# EasyEDA Pro project ProProject_ESP32-Gateway_2023-11-01.epro, board PCB1
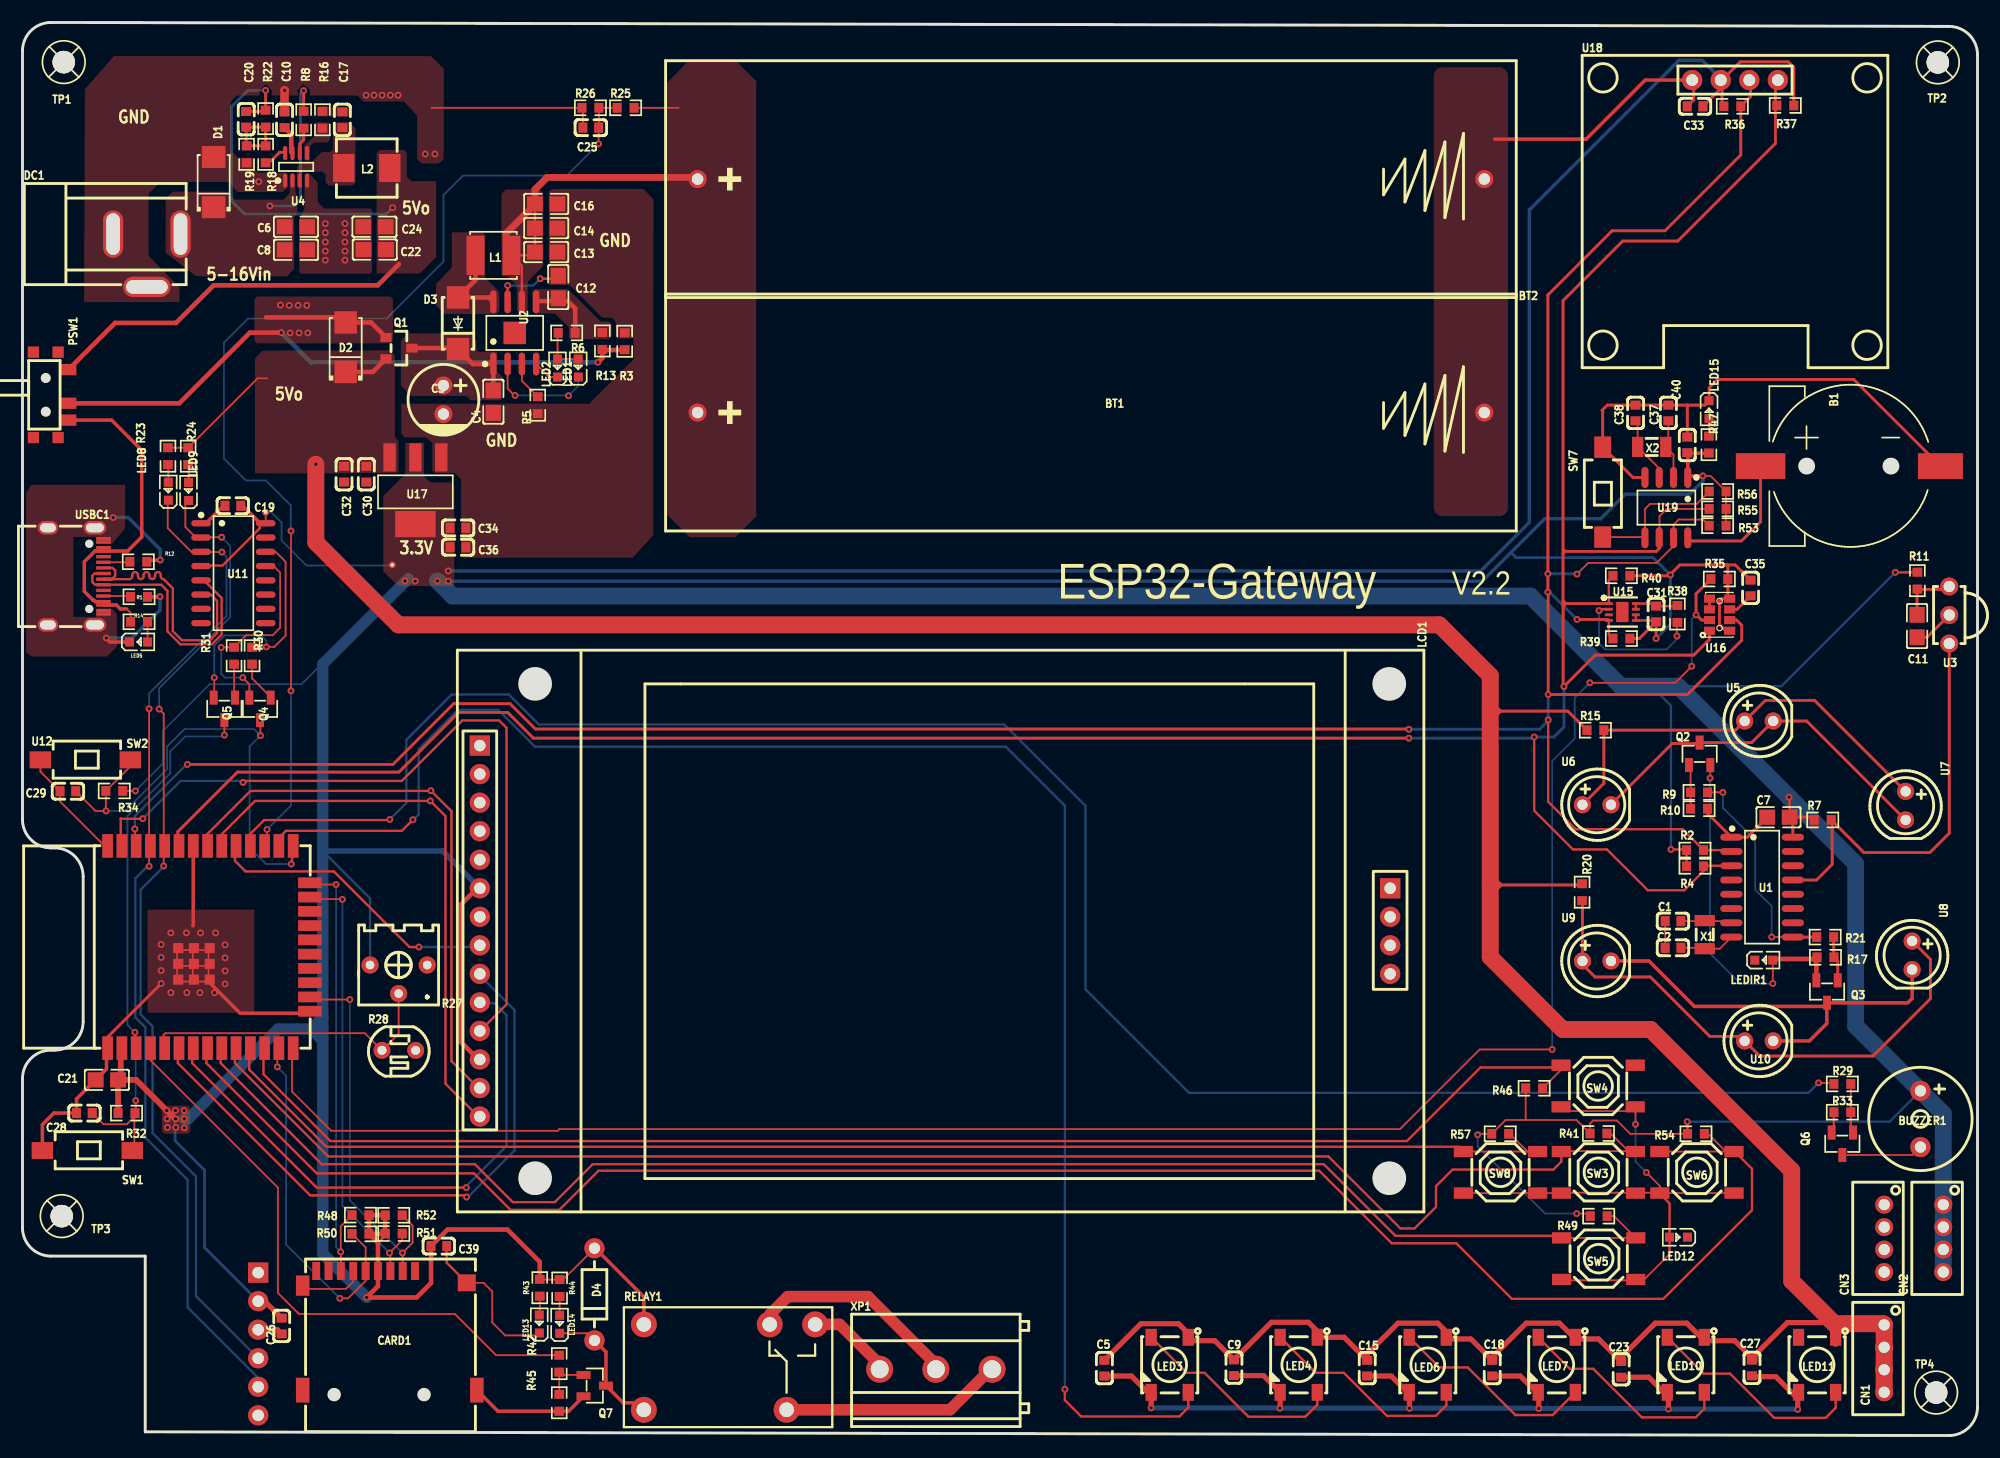
[diagram p4: board, top side]
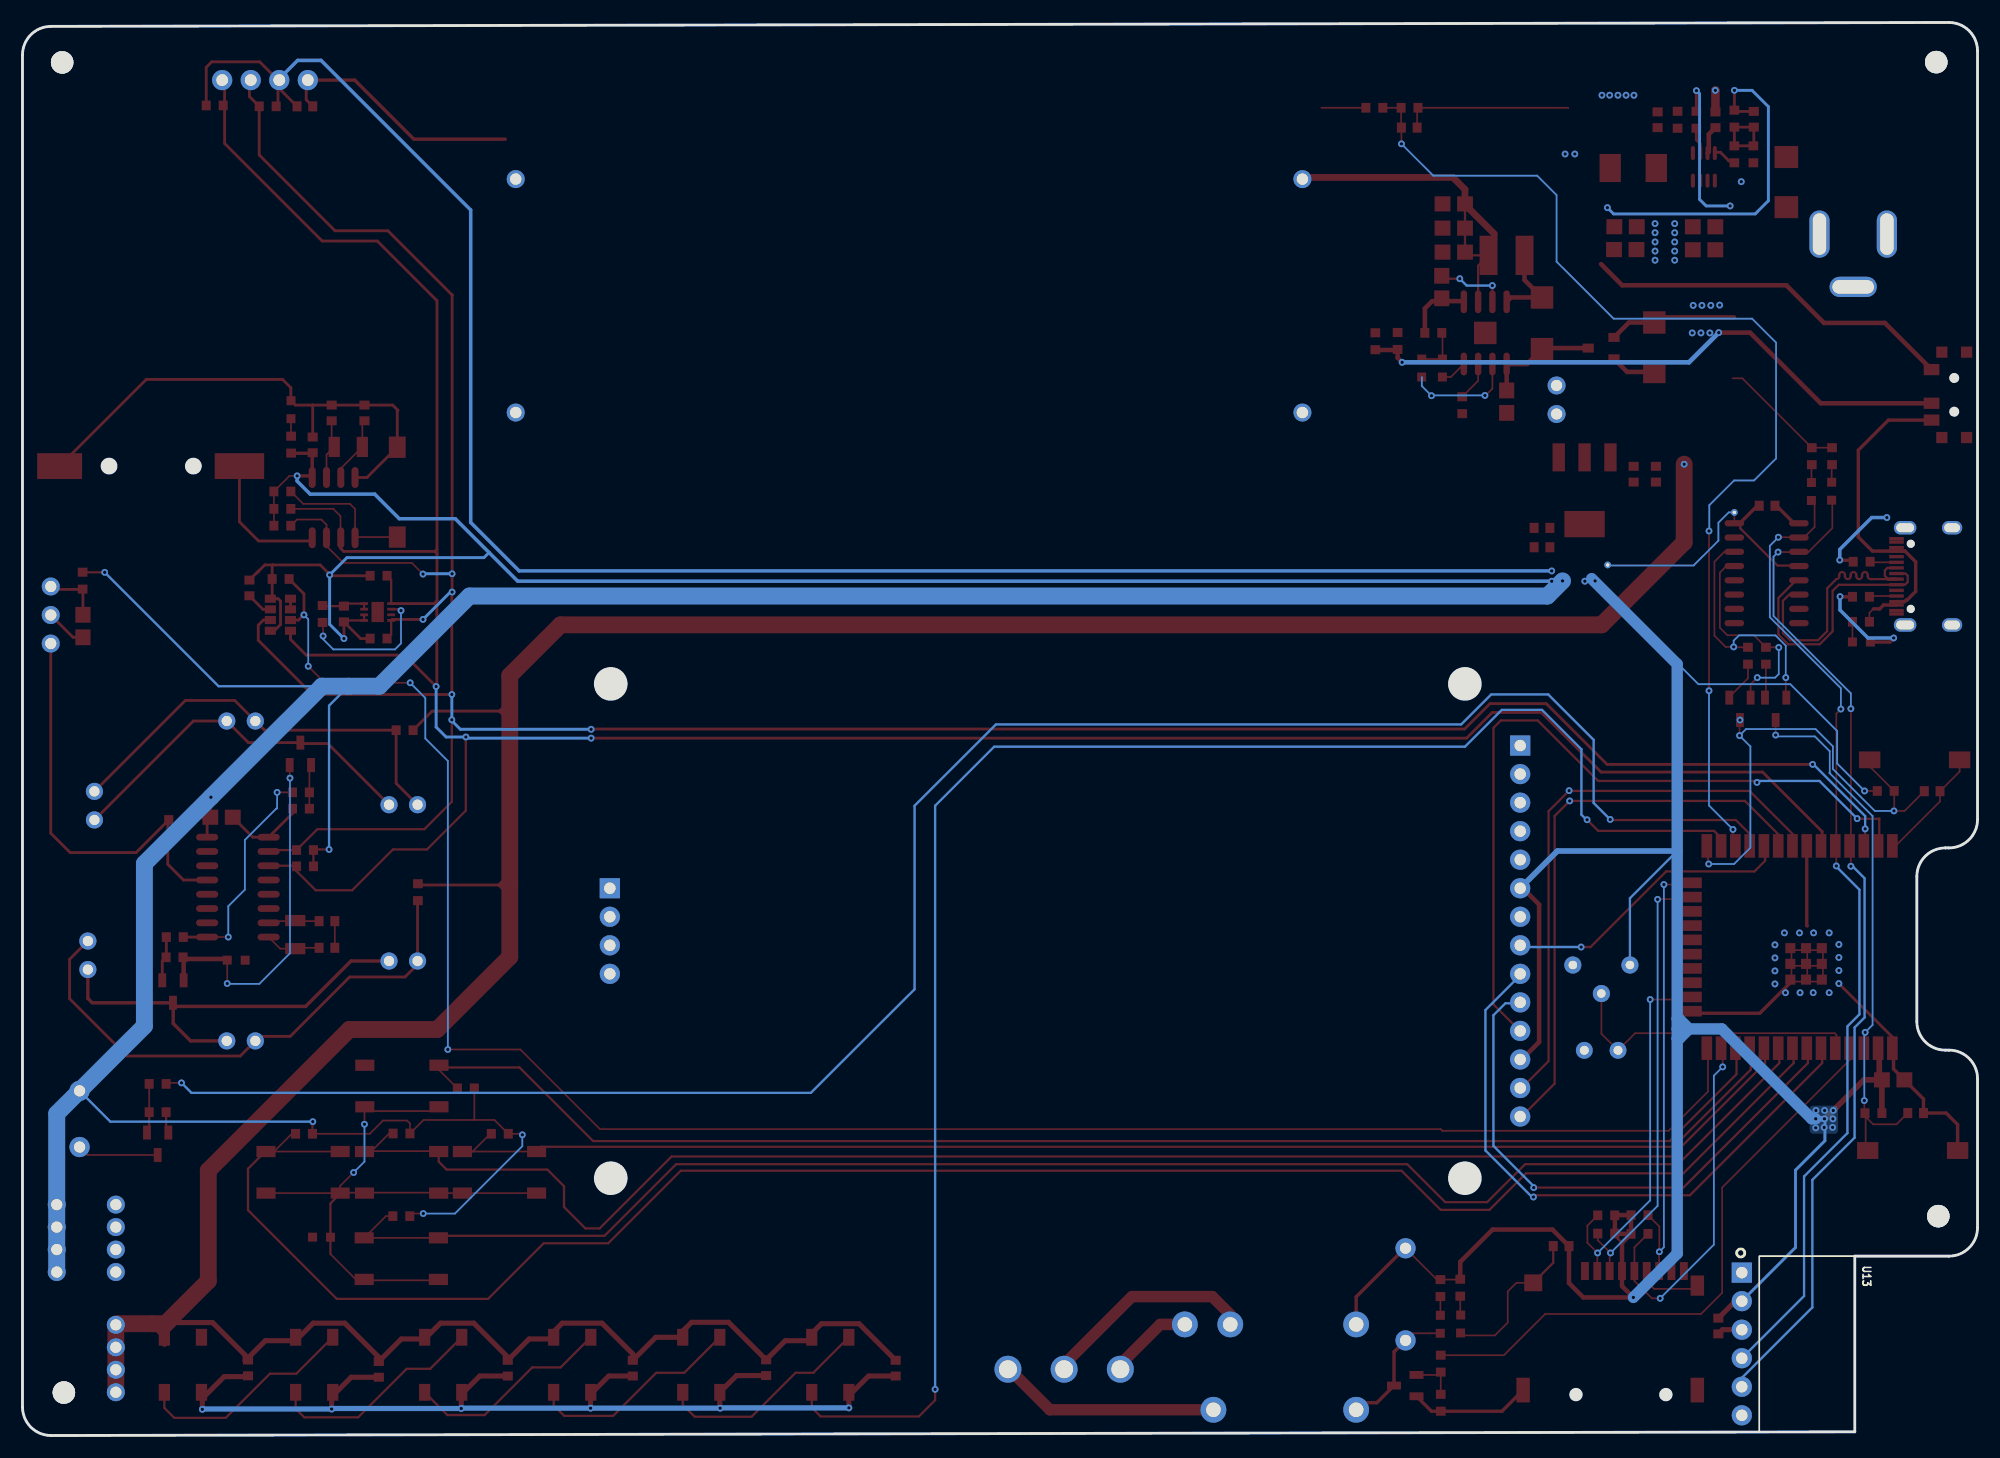
[diagram p5: board, bottom side, seen from below]

Outline 173.96 x 125.77 mm; copper layers: Top Layer, Bottom Layer. Coordinates in mm from the lower left corner of the outline.
Outline path: 0,123.23 0,54.84 arc(0.74,53.05) 2.54,52.3 2.86,52.3 arc(4.66,51.56) 5.4,49.76 5.4,36.84 arc(4.66,35.05) 2.86,34.3 2.54,34.3 arc(0.74,33.56) 0,31.76 0,18.51 arc(0.74,16.71) 2.54,15.97 10.92,15.97 10.92,0.33 171.41,0 arc(173.21,0.74) 173.96,2.54 173.96,122.89 arc(173.21,124.68) 171.42,125.43 2.55,125.77 arc(0.75,125.03) 0,123.23
Stack: Top Layer 0.035mm / Dielectric1 1.51mm FR4 er 4.5 / Bottom Layer 0.035mm

## Design rules (mm)
net USB_D-: DP1
net USB_D+: DP1
template: JLCPCB Capability(Two Layers Board)
spacing copperThickness1oz (default): track to track 0.102, other pairs 0.152 to 0.3
spacing copperThickness2oz: track to track 0.203, other pairs 0.152 to 0.3
track width copperThickness1oz (default): min 0.127, default 0.254, max 2.54
track width copperThickness2oz: min 0.203, default 0.254, max 2.54
differential pair differentialPair (default): width min 0.127, default 0.254, max 2.54; gap min 0.152, default 0.152
via viaSize (default): diameter min 0.5, default 0.61, max 10; hole min 0.3, default 0.305, max 6.3

## Placement (name value [footprint] x y rotation side)
B1  CR1220-2  [BAT-SMD_CR1220-2]  162.65 86.29 0 top
BT1  BH-18650  [BAT-TH_BH-18650-A1AJ005]  95.07 91.05 180 top
BT2  BH-18650  [BAT-TH_BH-18650-A1AJ005]  95.07 111.83 180 top
BUZZER1  HNB09A03  [BUZ-TH_BD9.0-P5.00-D0.6-FD]  168.88 28.18 270 top
C1  22pF  [C0603]  146.87 45.79 0 top
C2  22pF  [C0603]  146.87 43.41 0 top
C3  47uF  [CAP-TH_BD6.3-P2.50-D1.0-FD]  37.46 92.19 270 top
C4  100nF  [C0805]  41.9 92.02 90 top
C5  100nF  [C0603]  96.26 6 270 top
C6  22uF  [C0805]  24.33 107.59 180 top
C7  100nF  [C0805]  156.25 55.03 0 top
C8  100nF  [C0805]  24.33 105.54 180 top
C9  100nF  [C0603]  107.79 6.04 270 top
C10  0.1uF  [C0603]  23.32 117.12 90 top
C11  10uF  [C0805]  168.58 72.05 270 top
C12  10uF  [C0805]  47.67 102.22 270 top
C13  22uF  [C0805]  46.6 105.33 180 top
C14  22uF  [C0805]  46.6 107.47 180 top
C15  100nF  [C0603]  119.65 6 270 top
C16  100nF  [C0805]  46.6 109.63 180 top
C17  0.1uF  [C0603]  28.47 117.12 90 top
C18  100nF  [C0603]  130.78 6 270 top
C19  100nF  [C0603]  18.72 82.76 0 top
C20  33pF  [C0603]  19.91 117.16 270 top
C21  100nF  [C0805]  7.51 31.66 0 top
C22  22uF  [C0805]  31.35 105.56 0 top
C23  100nF  [C0603]  142.25 5.89 270 top
C24  22uF  [C0805]  31.32 107.59 0 top
C25  100nF  [C0603]  50.56 116.42 180 top
C26  4.7uF  [C0603]  23.06 9.75 270 top
C27  100nF  [C0603]  153.89 6.02 270 top
C28  100nF  [C0603]  5.51 28.7 180 top
C29  100nF  [C0603]  4.04 57.35 180 top
C30  10uF  [C0603]  30.6 85.57 90 top
C31  4.7uF  [C0603]  145.36 73.12 90 top
C32  100nF  [C0603]  28.62 85.57 90 top
C33  100nF  [C0603]  148.83 118.31 0 top
C34  10uF  [C0603]  38.75 80.79 180 top
C35  1uF  [C0603]  153.76 75.44 270 top
C36  100nF  [C0603]  38.75 79.07 180 top
C37  22pF  [C0603]  146.45 91.02 270 top
C38  22pF  [C0603]  143.53 91.02 270 top
C39  100nF  [C0603]  37.05 16.86 0 top
C40  1uF  [C0603]  148.13 88.17 90 top
CARD1  -  [TF-SMD_THD2528-11SD-GF]  32.68 9.34 0 top
CN1  B4B-PH-K-S(LF)(SN)  [CONN-TH_B4B-PH-K-S]  165.65 6.85 90 top
CN2  B4B-PH-K-S(LF)(SN)  [CONN-TH_B4B-PH-K-S]  170.91 17.55 90 top
CN3  B4B-PH-K-S(LF)(SN)  [CONN-TH_B4B-PH-K-S]  165.65 17.55 90 top
D1  SMAJ12A  [SMA_L4.4-W2.7-LS5.1-RD]  17.01 111.57 90 top
D2  -  [SMA_L4.3-W2.6-LS5.1-RD]  28.76 96.87 90 top
D3  SS34  [DO-214AC_L4.3-W2.7-LS5.3-RD]  38.75 99 90 top
D4  IN4148  [DO-35_BD2.0-L4.2-P8.20-D0.5-R-RD]  50.89 12.57 90 top
DC1  DC-005-2.5A-2.0  [CONN-TH_DC-005-2.5A-2.0]  11.06 104.59 0 top
L1  10uH  [IND-SMD_L4.0-W4.0]  41.91 105.05 0 top
L2  4.7uH  [IND-SMD_L5.4-W5.2_FXL0530]  30.63 112.82 0 top
LCD1  HS280S010B  [LCD-TH_HS280S010B]  81.19 44.9 270 top
LED1  XL-1608SURC-06  [LED0603-RD_RED]  49.46 95.02 90 top
LED2  XL-1608SURC-06  [LED0603-RD_RED]  47.61 95.02 90 top
LED3  WS2812C/W  [LED-SMD_4P-L5.0-W5.0-TL_WS2812B-B]  102.08 6.3 270 top
LED4  WS2812C/W  [LED-SMD_4P-L5.0-W5.0-TL_WS2812B-B]  113.56 6.3 270 top
LED5  XL-1608SURC-06  [LED0603-RD_RED]  10.33 70.63 0 top
LED6  WS2812C/W  [LED-SMD_4P-L5.0-W5.0-TL_WS2812B-B]  125.04 6.3 270 top
LED7  WS2812C/W  [LED-SMD_4P-L5.0-W5.0-TL_WS2812B-B]  136.52 6.3 270 top
LED8  XL-1608SURC-06  [LED0603-RD_RED]  12.98 84.05 90 top
LED9  XL-1608SURC-06  [LED0603-RD_RED]  14.78 84.03 90 top
LED10  WS2812C/W  [LED-SMD_4P-L5.0-W5.0-TL_WS2812B-B]  148 6.3 270 top
LED11  WS2812C/W  [LED-SMD_4P-L5.0-W5.0-TL_WS2812B-B]  159.68 6.3 270 top
LED12  XL-1608SURC-06  [LED0603-RD_RED]  147.35 17.65 180 top
LED13  XL-1608SURC-06  [LED0603-RD_RED]  45.99 9.93 90 top
LED14  19-217/GHC-YR1S2/3T  [LED0603-RD]  47.8 9.9 90 top
LED15  XL-1608SURC-06  [LED0603-RD_RED]  150.06 91.31 270 top
LEDIR1  XL-1608SURC-06  [LED0603-RD_RED]  154.94 42.31 0 top
NOREF  -  [Pad_e1718]  32.91 77.49 0 top
NOREF#2  -  [Pad_e1716]  21.64 82.16 0 top
PSW1  SK-3296S-01-L1  [SW-SMD_3P-P1.50_L2.7-W6.6]  2.53 92.63 270 top
Q1  -  [SOT-23_L2.9-W1.3-P1.90-LS2.4-BR]  33.49 96.79 180 top
Q2  SS8050  [SOT-23-3_L2.9-W1.3-P1.90-LS2.4-BR]  149.23 60.68 270 top
Q3  SS8050  [SOT-23-3_L2.9-W1.3-P1.90-LS2.4-BR]  160.57 39.52 90 top
Q4  SS8050  [SOT-23-3_L2.9-W1.3-P1.90-LS2.4-BR]  21.14 64.68 90 top
Q5  SS8050  [SOT-23-3_L2.9-W1.3-P1.90-LS2.4-BR]  17.96 64.68 90 top
Q6  SS8050  [SOT-23-3_L2.9-W1.3-P1.90-LS2.4-BR]  161.93 25.97 90 top
Q7  SS8050  [SOT-23-3_L2.9-W1.3-P1.90-LS2.4-BR]  50.92 4.44 180 top
R1  5.1kΩ  [R0603]  10.37 74.65 0 top
R2  10kΩ  [R0603]  148.82 52.11 180 top
R3  100k  [R0603]  53.59 97.4 270 top
R4  10kΩ  [R0603]  148.82 50.67 180 top
R5  1.1kΩ  [R0603]  45.85 91.71 90 top
R6  1kΩ  [R0603]  48.42 98.14 180 top
R7  10k  [R0603]  160.19 54.79 0 top
R8  100K  [R0603]  25.02 117.12 270 top
R9  1kΩ  [R0603]  149.18 57.25 180 top
R10  10kΩ  [R0603]  149.18 55.79 180 top
R11  100Ω  [R0603]  168.6 76.09 270 top
R12  5.1kΩ  [R0603]  10.31 77.78 0 top
R13  0Ω  [R0603]  51.6 97.43 90 top
R14  1kΩ  [R0603]  10.37 72.43 180 top
R15  100Ω  [R0603]  139.96 62.78 0 top
R16  10R  [R0603]  26.69 117.12 90 top
R17  10kΩ  [R0603]  160.43 42.57 0 top
R18  20K  [R0603]  21.64 114.04 270 top
R19  7.5K  [R0603]  19.94 114.04 90 top
R20  100Ω  [R0603]  138.77 48.36 270 top
R21  1kΩ  [R0603]  160.4 44.37 0 top
R22  40.2K  [R0603]  21.64 117.21 90 top
R23  1kΩ  [R0603]  12.95 87.17 90 top
R24  1kΩ  [R0603]  14.74 87.17 90 top
R25  1MΩ  [R0603]  53.67 118.18 0 top
R26  2MΩ  [R0603]  50.54 118.18 0 top
R27  10kΩ  [RES-ADJ-TH_3362P]  33.47 40.61 180 top
R28  GL5506(4-7K)  [RES-TH_L5.1-W4.3-P3.00-D0.5]  33.49 34.29 0 top
R29  1KΩ  [R0603]  161.93 31.3 180 top
R30  10kΩ  [R0603]  20.43 69.41 90 top
R31  10kΩ  [R0603]  18.83 69.41 90 top
R32  10kΩ  [R0603]  9.26 28.7 180 top
R33  10kΩ  [R0603]  161.93 28.78 180 top
R34  10kΩ  [R0603]  8.17 57.37 0 top
R35  10kΩ  [R0603]  150.99 76.24 0 top
R36  10kΩ  [R0603]  152.14 118.31 180 top
R37  10kΩ  [R0603]  156.85 118.39 0 top
R38  10kΩ  [R0603]  147.25 73.13 270 top
R39  10kΩ  [R0603]  142.27 70.94 180 top
R40  10kΩ  [R0603]  142.27 76.53 180 top
R41  10KΩ  [R0603]  140.23 26.88 0 top
R42  1kΩ  [R0603]  47.76 6.4 90 top
R43  1kΩ  [R0603]  47.79 13.13 90 top
R44  1kΩ  [R0603]  46.03 13.16 270 top
R45  10kΩ  [R0603]  47.76 2.91 270 top
R46  10KΩ  [R0603]  134.51 30.91 0 top
R47  1KΩ  [R0603]  150.06 88.2 270 top
R48  10k  [R0603]  30.08 19.62 180 top
R49  10KΩ  [R0603]  140.25 19.53 0 top
R50  10k  [R0603]  30.08 17.95 180 top
R51  10k  [R0603]  33.04 17.98 0 top
R52  10k  [R0603]  33.04 19.6 0 top
R53  10kΩ  [R0603]  150.83 80.98 180 top
R54  10KΩ  [R0603]  148.91 26.86 0 top
R55  10kΩ  [R0603]  150.83 82.48 180 top
R56  10kΩ  [R0603]  150.83 84.03 180 top
R57  10KΩ  [R0603]  131.49 26.86 0 top
RELAY1  HF32F/012-ZS3  [RELAY-TH_HF32F-012-ZS3]  62.91 6.09 0 top
SW1  TS-1101-C-W  [SW-SMD_L6.0-W3.3-LS8.0]  5.77 25.37 180 top
SW2  TS-1101-C-W  [SW-SMD_L6.0-W3.3-LS8.0]  5.59 60.14 180 top
SW3  TS-1187A-B-A-B  [SW-SMD_4P-L5.1-W5.1-P3.70-LS6.5-TL-2]  140.22 23.43 0 top
SW4  TS-1187A-B-A-B  [SW-SMD_4P-L5.1-W5.1-P3.70-LS6.5-TL-2]  140.2 31.11 0 top
SW5  TS-1187A-B-A-B  [SW-SMD_4P-L5.1-W5.1-P3.70-LS6.5-TL-2]  140.25 15.74 0 top
SW6  TS-1187A-B-A-B  [SW-SMD_4P-L5.1-W5.1-P3.70-LS6.5-TL-2]  148.99 23.43 0 top
SW7  TS-1101-C-W  [SW-SMD_L6.0-W3.3-LS8.0]  140.61 83.97 90 top
SW8  TS-1187A-B-A-B  [SW-SMD_4P-L5.1-W5.1-P3.70-LS6.5-TL-2]  131.51 23.43 0 top
TP1  -  [M2螺丝]  3.67 122.25 0 top
TP2  -  [M2螺丝]  170.43 122.22 0 top
TP3  -  [M2螺丝]  3.49 19.53 0 top
TP4  -  [M2螺丝]  170.27 3.83 0 top
U1  IRTM1  [SOIC-16_L9.9-W3.9-P1.27-LS6.0-BL]  154.79 48.81 270 top
U2  TP5400  [SOIC-8_L5.0-W4.0-P1.27-LS6.0-BL-EP2.0]  43.8 98.14 0 top
U3  BRM-2508  [SENSOR-TG_TSOP38236]  171.44 73.03 90 top
U4  MP2315  [SOT-23-8_L3.0-W1.7-P0.65-LS2.8-BR]  24.35 112.92 270 top
U5  IR333-A  [LED-TH_BD6.2-P2.54-FD]  154.51 63.6 0 top
U6  IR333-A  [LED-TH_BD6.2-P2.54-FD]  140.07 56.15 0 top
U7  IR333-A  [LED-TH_BD6.2-P2.54-FD]  167.56 56.06 270 top
U8  IR333-A  [LED-TH_BD6.2-P2.54-FD]  168.14 42.74 270 top
U9  IR333-A  [LED-TH_BD6.2-P2.54-FD]  140.07 42.24 0 top
U10  IR333-A  [LED-TH_BD6.2-P2.54-FD]  154.51 35.12 0 top
U11  CH340C  [SOP-16_L10.0-W3.9-P1.27-LS6.0-BL]  18.77 76.75 270 top
U12  ESP32-WROOM-32E-N8  [WIFI-SMD_ESP32-WROOM-32E]  16.58 43.48 0 top
U13  1*6Pin  [CONN-TH_6P-P2.54_DEALON_DW254W-11-06-85]  20.97 8.15 270 bottom
U15  SHT30-DIS-B10KS  [DFN-8_L2.5-W2.5-P0.50-BL-EP]  142.35 73.3 270 top
U16  -  [SENSOR-SMD_L3.9-W2.4-P0.95-BL]  151.01 73.06 0 top
U17  AMS1117-3.3  [SOT-223-3_L6.5-W3.4-P2.30-LS7.0-BR]  34.96 84.09 90 top
U18  OLED Panel  [OLED-TH_L27.8-W27.2-P2.54_C9900033791]  152.38 120.65 0 top
U19  DS1302ZM  [SOP-8_L4.9-W3.9-P1.27-LS6.0-BL]  146.27 82.59 180 top
USBC1  TYPE-C-31-M-12  [USB-C_SMD-TYPE-C-31-M-12]  4.74 76.48 270 top
X1  22.1184kHz  [FC-135R_L3.2-W1.5]  149.69 44.59 90 top
X2  32.768kHz  [FC-135R_L3.2-W1.5]  144.97 87.99 0 top
XP1  KF128L-5.0-3P  [CONN-TH_3P-P5.00_KF128L-5.0-3P]  81.27 5.9 0 top

## Footprints (pads in the part's own frame, mm; a bottom-side part is the same pattern mirrored in y, then rotated)
BAT-SMD_CR1220-2
  rect 4.4x2.3 smd: 1(-8,0)
  rect 4x2.3 smd: 2(8,0)
BAT-TH_BH-18650-A1AJ005
  round 1.6 hole 1.02: 1(-35,0) 2(35,0)
BUZ-TH_BD9.0-P5.00-D0.6-FD
  round 1.8 hole 1: 1(-2.5,0) 2(2.5,0)
C0603
  rect 0.8x0.9 smd: 1(-0.7,0) 2(0.7,0)
C0805
  rect 1.41x1.35 smd: 1(-1,0) 2(1,0)
CAP-TH_BD6.3-P2.50-D1.0-FD
  round 1.6 hole 1: 1(-1.27,0) 2(1.27,0)
CONN-TH_3P-P5.00_KF128L-5.0-3P
  round 2.4 hole 1.6: 1(-5,0) 2(0,0) 3(5,0)
CONN-TH_6P-P2.54_DEALON_DW254W-11-06-85
  rect 1.8x1.8 hole 1.02: 1(-6.35,0)
  round 1.8 hole 1.02: 2(-3.81,0) 3(-1.27,0) 4(1.27,0) 5(3.81,0) 6(6.35,0)
CONN-TH_B4B-PH-K-S
  round 1.6 hole 1: 1(3,0) 2(1,0) 3(-1,0) 4(-3,0)
CONN-TH_DC-005-2.5A-2.0
  oval 1.8x4.2 hole 1.2x3.7: 1(2.999,2.35) 2(-2.999,2.35)
  oval 4.2x1.8 hole 3.7x1.2: 3(0,-2.35)
DFN-8_L2.5-W2.5-P0.50-BL-EP
  rect 0.25x0.7 smd: 1(-0.75,-1.2) 2(-0.25,-1.2) 3(0.25,-1.2) 4(0.75,-1.2) 5(0.75,1.2) 6(0.25,1.2) 7(-0.25,1.2) 8(-0.75,1.2)
  rect 1.8x1.1 smd: 9(0,0)
DO-35_BD2.0-L4.2-P8.20-D0.5-R-RD
  round 1.8 hole 1: 1(4.1,0) 2(-4.1,0)
DO-214AC_L4.3-W2.7-LS5.3-RD
  rect 2x2 smd: 1(-2.3,0) 2(2.3,0)
FC-135R_L3.2-W1.5
  rect 1x1.8 smd: 1(-1.25,0) 2(1.25,0)
IND-SMD_L4.0-W4.0
  rect 1.6x3.5 smd: 1(-1.6,0) 2(1.6,0)
IND-SMD_L5.4-W5.2_FXL0530
  rect 1.9x2.5 smd: 1(-2.05,0) 2(2.05,0)
LCD-TH_HS280S010B
  rect 1.8x1.8 hole 1.02: 1(-16.51,-40.5) 15(-3.81,40.5)
  round 1.8 hole 1.02: 2(-13.97,-40.5) 3(-11.43,-40.5) 4(-8.89,-40.5) 5(-6.35,-40.5) 6(-3.81,-40.5) 7(-1.27,-40.5) 8(1.27,-40.5) 9(3.81,-40.5) 10(6.35,-40.5) 11(8.89,-40.5) 12(11.43,-40.5) 13(13.97,-40.5) 14(16.51,-40.5) 16(-1.27,40.5) 17(1.27,40.5) 18(3.81,40.5)
LED0603-RD
  rect 0.8x0.8 smd: 1(-0.799,-0.004) 2(0.799,0.004)
LED0603-RD_RED
  rect 0.8x0.8 smd: 1(-0.799,-0.004) 2(0.799,0.004)
LED-SMD_4P-L5.0-W5.0-TL_WS2812B-B
  rect 1.5x1 smd: 1(-2.45,1.65) 2(-2.45,-1.65) 3(2.45,-1.65) 4(2.45,1.65)
LED-TH_BD6.2-P2.54-FD
  round 1.524 hole 0.914: 1(-1.27,0) 2(1.27,0)
M2螺丝
  round 2 hole 2: 1(0,0)
OLED-TH_L27.8-W27.2-P2.54_C9900033791
  round 1.8 hole 1.05: 1(-3.81,0) 2(-1.27,0) 3(1.27,0) 4(3.81,0)
Pad_e1716
  round 0.61 hole 0.305: 40(0,0)
Pad_e1718
  round 0.61 hole 0.305: 40(0,0)
R0603
  rect 0.806x0.864 smd: 1(-0.753,0) 2(0.753,0)
RELAY-TH_HF32F-012-ZS3
  round 2.3 hole 1.3: 1(-7.62,-3.8) 2(-7.62,3.8) 3(3.58,3.8) 4(7.62,3.8) 5(5.08,-3.8)
RES-ADJ-TH_3362P
  round 1.524 hole 0.762: 1(-2.54,-1.27) 2(0,1.27) 3(2.54,-1.27)
RES-TH_L5.1-W4.3-P3.00-D0.5
  round 1.5 hole 0.8: 1(-1.5,0) 2(1.5,0)
SENSOR-SMD_L3.9-W2.4-P0.95-BL
  rect 0.986x0.719 smd: 1(-0.896,-1.425) 2(-0.896,-0.475) 3(-0.896,0.475) 4(-0.896,1.425) 5(0.896,1.425) 6(0.896,0.475) 7(0.896,-0.475) 8(0.896,-1.425)
SENSOR-TG_TSOP38236
  round 1.6 hole 1: 1(-2.54,0) 2(0,0) 3(2.54,0)
SMA_L4.3-W2.6-LS5.1-RD
  rect 1.999x1.999 smd: 1(-2.2,0) 2(2.2,0)
SMA_L4.4-W2.7-LS5.1-RD
  rect 1.96x2.1 smd: 1(-2.23,0) 2(2.23,0)
SOIC-8_L5.0-W4.0-P1.27-LS6.0-BL-EP2.0
  oval 0.574x2.038 smd: 1(-1.905,-2.769) 2(-0.635,-2.769) 3(0.635,-2.769) 4(1.905,-2.769) 5(1.905,2.769) 6(0.635,2.769) 7(-0.635,2.769) 8(-1.905,2.769)
  rect 2x2 smd: 9(0,0)
SOIC-16_L9.9-W3.9-P1.27-LS6.0-BL
  oval 0.602x1.971 smd: 1(-4.445,-2.736) 2(-3.175,-2.736) 3(-1.905,-2.736) 4(-0.635,-2.736) 5(0.635,-2.736) 6(1.905,-2.736) 7(3.175,-2.736) 8(4.445,-2.736) 9(4.445,2.736) 10(3.175,2.736) 11(1.905,2.736) 12(0.635,2.736) 13(-0.635,2.736) 14(-1.905,2.736) 15(-3.175,2.736) 16(-4.445,2.736)
SOP-8_L4.9-W3.9-P1.27-LS6.0-BL
  oval 0.63x1.865 smd: 1(-1.905,-2.683) 2(-0.635,-2.683) 3(0.635,-2.683) 4(1.905,-2.683) 5(1.905,2.683) 6(0.635,2.683) 7(-0.635,2.683) 8(-1.905,2.683)
SOP-16_L10.0-W3.9-P1.27-LS6.0-BL
  oval 0.56x1.745 smd: 1(-4.445,-2.873) 2(-3.175,-2.873) 3(-1.905,-2.873) 4(-0.635,-2.873) 5(0.635,-2.873) 6(1.905,-2.873) 7(3.175,-2.873) 8(4.445,-2.873) 9(4.445,2.873) 10(3.175,2.873) 11(1.905,2.873) 12(0.635,2.873) 13(-0.635,2.873) 14(-1.905,2.873) 15(-3.175,2.873) 16(-4.445,2.873)
SOT-23-3_L2.9-W1.3-P1.90-LS2.4-BR
  rect 1.25x0.7 smd: 1(1,-0.95) 2(1,0.95) 3(-1,0)
SOT-23-8_L3.0-W1.7-P0.65-LS2.8-BR
  oval 1.252x0.364 smd: 1(1.226,-0.975) 2(1.226,-0.325) 3(1.226,0.325) 4(1.226,0.975) 5(-1.226,0.975) 6(-1.226,0.325) 7(-1.226,-0.325) 8(-1.226,-0.975)
SOT-23_L2.9-W1.3-P1.90-LS2.4-BR
  rect 1.001x0.8 smd: 1(1.151,-0.95) 2(1.151,0.95) 3(-1.151,0)
SOT-223-3_L6.5-W3.4-P2.30-LS7.0-BR
  rect 2.5x1.1 smd: 1(2.97,-2.3) 2(2.97,0) 3(2.97,2.3)
  rect 2.34x3.6 smd: 4(-2.97,0)
SW-SMD_3P-P1.50_L2.7-W6.6
  rect 1x1 smd: 0(-3.8,0.641) 0(-3.8,-1.559) 0(3.8,0.641) 0(3.8,-1.559)
  rect 1x1.4 smd: 1(-2.25,1.559) 2(0.75,1.559) 3(2.25,1.559)
SW-SMD_4P-L5.1-W5.1-P3.70-LS6.5-TL-2
  rect 1.7x1 smd: 1(-3.3,1.85) 2(3.3,1.85) 3(-3.3,-1.85) 4(3.3,-1.85)
SW-SMD_L6.0-W3.3-LS8.0
  rect 1.9x1.5 smd: 1(-4,0) 2(4,0)
TF-SMD_THD2528-11SD-GF
  rect 0.701x1.6 smd: 1(2.251,5.301) 2(1.151,5.301) 3(0.051,5.301) 4(-1.049,5.301) 5(-2.149,5.301) 6(-3.248,5.301) 7(-4.351,5.301) 8(-5.451,5.301) 9(-6.551,5.301)
  rect 1.199x1.801 smd: 10(-7.75,4)
  rect 1.199x2.2 smd: 11(-7.75,-5.301) 12(7.75,-5.301)
  rect 1.6x1.501 smd: 13(6.851,4.25)
USB-C_SMD-TYPE-C-31-M-12
  oval 1.2x2 hole 0.8x1.6: 0(-4.325,1.706) 1(4.325,1.706)
  oval 1.2x1.8 hole 0.8x1.4: 2(4.325,-2.474) 3(-4.325,-2.474)
  rect 0.3x1.3 smd: A1(-3.35,2.474) A4(-2.55,2.474) A5(-1.25,2.474) A6(-0.25,2.474) A7(0.25,2.474) A8(1.25,2.474) A9(2.55,2.474) A12(3.35,2.474) B1(3.05,2.474) B4(2.25,2.474) B5(1.75,2.474) B6(0.75,2.474) B7(-0.75,2.474) B8(-1.75,2.474) B9(-2.25,2.474) B12(-3.05,2.474)
WIFI-SMD_ESP32-WROOM-32E
  rect 0.95x2.1 smd: 1(-9.002,-9) 2(-7.732,-9) 3(-6.463,-9) 4(-5.192,-9) 5(-3.922,-9) 6(-2.652,-9) 7(-1.383,-9) 8(-0.113,-9) 9(1.157,-9) 10(2.428,-9) 11(3.697,-9) 12(4.968,-9) 13(6.237,-9) 14(7.508,-9) 25(7.508,9) 26(6.237,9) 27(4.968,9) 28(3.697,9) 29(2.428,9) 30(1.157,9) 31(-0.113,9) 32(-1.383,9) 33(-2.652,9) 34(-3.922,9) 35(-5.192,9) 36(-6.463,9) 37(-7.732,9) 38(-9.002,9)
  rect 2.1x0.95 smd: 15(9.002,-5.715) 16(9.002,-4.445) 17(9.002,-3.175) 18(9.002,-1.905) 19(9.002,-0.635) 20(9.002,0.635) 21(9.002,1.905) 22(9.002,3.175) 23(9.002,4.445) 24(9.002,5.715)
  rect 0.9x0.9 smd: 39(-2.721,-0.1) 39(-2.721,-1.5) 39(-2.721,-2.9) 39(-1.321,-0.1) 39(-1.321,-1.5) 39(-1.321,-2.9) 39(0.079,-0.1) 39(0.079,-1.5) 39(0.079,-2.9)

## Nets
As in the schematic, except:
3.3V: BUZZER1.1 C7.2 C19.2 C21.2 C26.1 C31.1 C33.2 C34.2 C35.1 C36.2 C39.1 C40.1 CARD1.4 CN2.1 CN2.2 CN2.3 CN2.4 D4.1 LCD1.6 LCD1.12 NOREF.40 NOREF#2.40 R2.2 R4.2 R7.1 R11.1 R27.3 R32.2 R34.2 R35.2 R36.2 R37.2 R39.1 R40.1 R41.1 R43.2 R44.1 R46.1 R47.2 R48.1 R49.1 R50.1 R51.1 R52.1 R53.1 R54.1 R55.1 R56.1 R57.1 RELAY1.2 U1.16 U11.4 U11.16 U12.2 U13.2 U15.5 U15.6 U16.5 U16.8 U17.2 U17.4 U18.2 U19.1

Pads without a net: CARD1 1 8 9; LCD1 1 2 3 4 5 15 16 17 18; LED11 2; PSW1 0; R27 1; TP1 1; TP2 1; TP3 1; TP4 1; U1 4 5 6 10 11 12 14 15; U11 7 8 9 10 11 12 15; U12 17 18 19 20 21 22; U13 1 6; U15 3; USBC1 A8 B8

## Via types
v1: diameter 0.61, hole 0.305, Top Layer to Bottom Layer, 152 vias

## Routing (per net, layer and track width the routed paths; a pad name or vN(x,y) marks a point on that pad's centre or on a via; arc(x,y) is an arc through that point)
3.3V: length 903.1
  Top Layer w0.152: v1(149.52,85.42) 150.2,85.42 R56.1 R55.1 R53.1 ; 133.83,28.09 133.75,28.17 R46.1 ; 133.83,28.09 131.96,28.09 R57.1 129.57,26.86 v1(129.48,26.77) ; 133.83,28.09 138.27,28.09 R41.1 139.48,27.77 139.74,28.04 141.88,28.04 143.06,26.86 148.15,26.86 ; v1(138.3,19.76) 139.27,19.76 R49.1 ; R44.1 46.06,13.88 R43.2 48.11,13.88 D4.1 ; R34.2 v1(10.05,57.37) ; 32.27,19.62 R52.1 ; 21.64,82.09 U11.16
  Top Layer w0.203: R11.1 168.59,76.83 v1(166.64,76.83) ; U15.6 U15.5 145.23,72.55 C31.1 ; v1(157.19,56.82) 157.25,56.76 C7.2 ; R4.2 R2.2 148.01,52.17 v1(146.68,52.17) ; 148.15,26.86 148.15,27.91 v1(148.12,27.94) ; 31.63,17.15 32.28,17.8 R51.1 ; 15.66,77.43 17.8,77.43 21.11,80.75 21.11,81.24
  Top Layer w0.254: 151.71,77.49 152.39,77.49 152.94,76.95 ; 151.71,77.49 151.74,77.46 R35.2 151.74,74.65 U16.5 151.21,74.48 151,74.27 151,72.18 151.54,71.63 151.9,71.63 ; 151.71,77.49 147.46,77.49 146.63,76.65 v1(146.63,76.6) 146.55,76.53 R40.1 ; 152.94,76.95 152.96,76.95 C35.1 ; 152.94,76.95 153.13,76.75 ; v1(145.36,70.94) C31.1 143.87,70.94 R39.1 ; C33.2 151.22,120.01 ; 151.22,120.01 151.22,120.65 152.85,122.27 157.12,122.27 157.61,121.78 R37.2 ; 151.22,120.01 151.25,120.03 151.25,120.59 ; 151.22,120.01 151.22,118.47 R36.2 ; R7.1 159.19,55.03 C7.2 157.53,54.75 U1.16
  Top Layer w0.305: R47.2 150.04,87.43 148.18,87.43 ; 51.62,16.67 D4.1 ; 21.17,81.18 19.59,82.76 C19.2 ; 148.18,87.43 U19.1 148.32,85.42 v1(149.52,85.42) ; 148.18,87.43 C40.1 ; RELAY1.2 55.29,12.34 51.02,16.61
  Top Layer w0.4: R50.1 32.26,17.95 R51.1 32.27,17.99 32.27,19.62 R48.1 R50.1 ; R50.1 31.63,17.15 CARD1.4 31.63,13.3 v1(30.62,12.29) 35.07,12.29 36.35,13.57 C39.1 37.82,18.33 43.15,18.33 46.03,15.45 R44.1
  Top Layer w0.406: 40.63,48.64 40.38,48.64 39.01,47.27 39.01,35.02 40.63,33.4
  Top Layer w0.457: C26.1 21.55,11.96 U13.2
  Top Layer w0.508: 13.58,28.19 v1(12.84,28.93) 10.11,31.66 C21.2 ; 8.74,34.3 8.74,31.89 C21.2 ; C21.2 R32.2
  Bottom Layer w0.152: v1(129.48,26.77) 129.48,25.75 135.48,19.76 v1(138.3,19.76) ; NOREF#2.40 22.14,82.16 23.06,81.25 23.06,79.65 25.27,77.44 32.86,77.44 NOREF.40 ; v1(34.03,76.07) 24.83,66.87 16.65,66.87 12.49,62.71 12.49,59.81 v1(10.05,57.37)
  Bottom Layer w0.2: R27.3 30.93,47.82 26.72,52.03
  Bottom Layer w0.203: v1(148.12,27.94) 166.13,27.94 BUZZER1.1 ; v1(146.68,52.17) 146.68,64.96 144.95,66.7 ; v1(166.64,76.83) 156.51,66.7 147.31,66.7
  Bottom Layer w0.254: U13.2 16.2,16.73 16.2,23.62 13.58,26.23 13.58,28.19 ; 132.44,78.59 132.89,78.14 145.09,78.14 v1(146.63,76.6) 146.63,72.21 v1(145.36,70.94)
  Bottom Layer w0.305: v1(37.89,76.04) 129.89,76.04 132.44,78.59 135.45,81.61 140.43,81.61 142.61,83.79 148.35,83.79 149.52,84.96 v1(149.52,85.42) ; 151.22,120.65 149.47,122.4 147.39,122.4 134.08,109.09 134.08,81.28 129.76,76.96 v1(37.89,76.96)
  Bottom Layer w0.5: LCD1.6 37.38,52.03 26.72,52.03
  Bottom Layer w0.508: 13.58,28.19 v1(14.4,28.19)
  Bottom Layer w1: 25.67,36.19 26.58,37.1 26.72,37.1 ; 25.67,36.19 22.75,36.19 14.75,28.19 v1(14.4,28.19) ; 25.67,36.19 26.52,35.34 26.72,35.34 ; 25.67,36.19 26.72,36.19 ; 26.72,36.19 26.72,35.34 ; 26.72,36.19 26.72,37.1 ; 26.72,35.34 26.72,16.19 v1(30.62,12.29) ; 26.72,37.1 26.72,68.66 34.33,76.27
  Bottom Layer w1.5: CN2.4 CN2.3 CN2.2 CN2.1 170.91,28.65 BUZZER1.1 163.11,36.44 163.11,50.9 v1(157.19,56.82) 147.31,66.7 142.21,66.7 134.18,74.72 38.27,74.72 v1(36.92,76.07)
  vias: v1(12.87,28.19) v1(12.9,27.43) v1(13.61,28.93) v1(13.62,28.19) v1(13.65,27.43) v1(14.38,28.93) v1(14.4,27.38) v1(34.94,76.04)
5V: length 323.2
  Top Layer w0.152: R23.2 14.74,87.93 R24.2 20.92,94.1 21.78,94.1
  Top Layer w0.254: R15.1 137.5,64.48 131.52,64.48 ; R20.1 138.66,49 131.58,49 ; 131.13,48.54 131.13,48.55 131.58,49 ; 131.52,64.48 131.06,64.02 131.06,63.88 ; 131.52,64.48 131.13,64.86 131.13,64.92 ; 131.52,64.48 130.69,64.48 130.37,64.16 ; 131.58,49 130.6,49 ; 131.58,49 131.18,49.4 131.18,49.53
  Top Layer w0.406: D2.1 31.17,94.67 Q1.2
  Top Layer w0.457: 161.33,8.79 162.43,9.88 162.43,9.95 ; 161.33,8.79 161.33,9.06 160.34,10.05 157.04,10.05 154.15,7.16 154.15,6.64 152.35,8.44 149.65,8.44 148.09,10 145.28,10 142.25,6.97 C23.1 140.25,8.59 138.17,8.59 136.76,10 133.8,10 130.78,6.98 C18.1 128.88,8.59 126.69,8.59 126.69,9.24 125.93,10 122.39,10 119.65,7.26 C15.1 117.6,8.75 LED4.1 115.21,9.29 114.42,10.08 111.13,10.08 C9.1 106.09,8.44 103.73,8.44 103.73,9.09 102.86,9.95 99.52,9.95 C5.1 ; 161.33,8.79 161.33,8.12
  Top Layer w1.5: CN1.4 CN1.3 CN1.2 CN1.1 165.55,9.95 161.23,9.95 157.42,13.76 157.42,23.59 144.87,36.14 137.05,36.14 130.6,42.59 130.6,67.64 126.08,72.16 33.44,72.16 26.1,79.5 v1(26.1,86.46)
GND: length 325.8
  Top Layer w0.152: C25.2 49.86,118.1 R26.1 36.44,118.18 36.42,118.16 ; CARD1.10 25.22,13.05 28.77,13.05 29.43,13.71 CARD1.6 ; 7.47,52.3 3.34,56.44 C29.2 1.59,59.09 1.59,60.14 ; 39.53,13.59 41.03,13.59 41.8,12.82 41.8,10.05 42.94,8.91 45.78,8.91 LED13.1 ; 16.56,41.8 16.56,43.2 15.16,43.2 ; 16.55,41.8 15.16,41.8 ; 16.56,41.8 16.56,40.4 15.16,40.4 ; 15.16,43.2 13.75,43.2 13.75,41.8 ; 15.16,43.2 15.16,41.8 ; 15.16,41.8 15.16,40.4 ; 15.15,41.8 13.75,41.8 ; 15.16,40.4 13.75,40.4 13.75,41.8 ; C2.1 C1.1
  Top Layer w0.203: R38.1 147.2,73.83 C31.2 145.13,74.05 U15.8 U15.7 ; 161.18,29.11 161.18,27.17 Q6.2 ; v1(43.17,102.36) 43.17,102.35 U2.7 ; 47.89,103.22 47.63,102.97 v1(46.07,102.97) ; 39.53,13.59 37.75,15.37 C39.2
  Top Layer w0.254: C33.1 148.71,118.89 148.71,120.59 ; B1.2 162.94,94 150.82,94 150.08,93.26 150.08,92.13 149.67,91.72 148.13,91.72 ; U16.6 152.55,73.53 C35.2 ; v1(12.34,40.23) 7.58,35.47 U12.1 ; U3.2 169.46,71.05 C11.2 ; C40.2 148.13,91.72 148.13,91.72 ; U19.4 143.3,85.27 SW7.2 140.61,91.21 140.56,91.26 141.02,91.72 C38.1 C37.1 148.13,91.72 ; R10.1 149.93,55.38 U1.1 153.47,53.26 C7.1
  Top Layer w0.305: 17.96,82.83 16.31,81.18 15.43,81.18 ; 7.47,34.3 7.47,32.62 C21.1 4.81,29.96 C28.2 2.79,28.7 1.77,27.68 SW1.2 ; U18.1 144.39,120.65 139.13,115.39 131,115.39 ; 11.13,74.65 12.22,74.65 v1(12.23,74.67) ; 15.16,45.36 15.2,45.4 U12.32 ; 16.56,40.4 19.37,37.59 25.48,37.59 ; 7.51,70.91 7.79,70.63 9.53,70.63 ; CARD1.12 42.31,2.16 R45.2 48.59,2.16 Q7.2 ; 11.06,77.9 12.24,77.9 v1(12.26,77.92)
  Top Layer w0.457: v1(111.88,2.43) 111.91,2.47 LED4.3 110.42,5.34 C9.2 ; v1(100.42,2.46) 100.43,2.46 100.43,3.54 98.67,5.3 C5.2 ; C18.2 133.27,5.3 134.92,3.65 v1(134.92,2.41) ; v1(146.45,2.36) 146.45,3.44 144.7,5.19 C23.2 ; C15.2 121.79,5.3 123.41,3.67 v1(123.41,2.43) ; v1(157.96,2.33) 157.96,3.29 156.01,5.24 154.15,5.24 ; C26.2 22.69,9.42 U13.3
  Top Layer w0.762: v1(23.33,119.73) 23.32,119.72 C10.2
  Bottom Layer w0.203: v1(43.17,102.36) 45.46,102.36 v1(46.07,102.97)
  Bottom Layer w0.305: v1(12.26,77.92) 12.26,78.86 9.42,81.71 v1(8.07,81.71) ; v1(12.23,74.67) 12.23,73.48 9.75,70.99 v1(7.46,70.99)
  Bottom Layer w0.457: v1(100.42,2.46) 111.85,2.46 v1(111.88,2.43) v1(123.41,2.43) 134.89,2.43 v1(134.92,2.41) 146.4,2.41 v1(146.45,2.36) 157.93,2.36 v1(157.95,2.33)
  vias: v1(12.34,43.71) v1(12.34,42.55) v1(12.34,41.39) v1(13.2,44.74) v1(13.2,39.42) v1(14.59,44.74) v1(14.62,39.42) v1(15.79,39.42) v1(15.84,44.74) v1(17.09,39.42) v1(17.18,44.74) v1(18.03,43.68) v1(18.03,42.52) v1(18.03,41.36) v1(18.03,40.19) v1(21.02,111.6) v1(26.95,107.87) v1(26.95,107.06) v1(26.95,106.24) v1(26.95,105.42) v1(26.95,104.61) v1(28.69,107.87) v1(28.69,107.06) v1(28.69,106.24) v1(28.69,105.43) v1(28.69,104.62) v1(30.57,119.3) v1(31.28,119.3) v1(32,119.3) v1(32.73,119.3) v1(33.42,119.3) v1(35.83,114.07) v1(36.7,114.07)
VIN_5V: length 66
  Top Layer w0.406: 51.6,96.62 51.6,96.83 ; 51.6,96.62 53.56,96.62 R3.2 ; 51.6,96.62 51.6,95.93 v1(51.2,95.53) ; 21.67,99.52 27.94,99.52 28.9,98.57 ; Q1.1 31.01,99.07 D2.2 ; v1(23.03,98.17) 20.24,98.17 13.95,91.88 PSW1.2
  Bottom Layer w0.406: v1(51.2,95.53) 25.67,95.53 v1(23.03,98.17)
  vias: v1(22.94,100.62) v1(23.73,100.59) v1(23.82,98.14) v1(24.52,100.59) v1(24.61,98.14) v1(25.3,100.59) v1(25.39,98.14)
$B1_1: length 12.3
  Top Layer w0.254: U19.8 148.46,79.62 152.95,79.62 154.65,81.33 B1.1
$BUZZER1_2: length 7.2
  Top Layer w0.152: Q6.3 168.17,24.97 BUZZER1.2
$C1_2: length 4.6
  Top Layer w0.152: C1.2 151.91,45.79 U1.7
  Top Layer w0.305: 149.64,45.79 X1.2
$C2_2: length 5.7
  Top Layer w0.152: X1.1 151.02,43.34 U1.8 ; X1.1 149.61,43.41 C2.2 ; X1.1 148.9,43.34
$C3_1: length 10.2
  Top Layer w0.406: C4.2 U2.1 40.08,95.37 D3.1 38.66,96.79 Q1.3
$C6_2: length 14.6
  Top Layer w0.254: R8.1 25.02,119.7 v1(25.01,119.71)
  Bottom Layer w0.254: v1(22.01,109.44) 24.15,109.44 24.73,110.03 24.73,119.43 v1(25.01,119.71)
$C10_1: length 2.6
  Top Layer w0.406: U4.7 23.91,114.26 23.91,115.82 C10.1
$C11_1: length 5.3
  Top Layer w0.254: 168.58,75.31 171.18,75.31 171.44,75.57 ; 168.58,75.31 C11.1 ; 168.58,75.31 R11.2
$C12_2: length 6
  Top Layer w0.152: 51.54,98.27 51.6,98.33
  Top Layer w0.406: R6.1 49.18,100.31 48.52,100.97 45.77,100.97 U2.5
$C20_2: length 6.8
  Top Layer w0.254: R18.1 R19.2 19.91,114.83 C20.2 21.63,116.46 R22.1 R18.1
$C37_2: length 5.4
  Top Layer w0.152: U19.2 146.91,87.31 X2.2 146.45,88.22 C37.2
$C38_2: length 5.9
  Top Layer w0.152: C38.2 143.72,90.13 X2.1 145.64,86.08 U19.3
$D3_2: length 7.7
  Top Layer w0.406: U2.8 41.51,101.3 D3.2 40.31,102.85 L1.1
$D4_2: length 12.1
  Top Layer w0.152: D4.2 50.26,9.1 LED14.1
  Top Layer w0.305: RELAY1.1 54.66,2.92 53.44,2.92 Q7.3 51.92,7.44 D4.2
$LED1_1: length 10
  Top Layer w0.152: v1(43.83,92.58) 43.83,92.51 43.17,93.18 U2.2
  Bottom Layer w0.152: v1(43.83,92.58) 48.56,92.58 v1(48.58,92.55) 49.45,93.42 49.45,94.2
$LED1_2: length 4.2
  Top Layer w0.152: 47.72,98.14 47.61,98.03 LED2.2 LED1.2
$LED2_1: length 2.4
  Top Layer w0.152: U2.4 46.86,94.22 47.61,94.22
$LED3_2: length 19.3
  Top Layer w0.203: LED4.4 115.21,2.74 114.14,1.67 109.09,1.67 105.17,5.58 103.59,5.58 LED3.2
$LED4_2: length 19.2
  Top Layer w0.203: LED6.4 126.69,2.69 125.75,1.75 121.4,1.75 117.57,5.58 115.07,5.58 LED4.2
$LED5_2: length 1.8
  Top Layer w0.152: 11.13,72.43 11.13,72.43 LED5.2
$LED6_2: length 18.5
  Top Layer w0.203: LED7.4 136.15,1.82 132.83,1.82 128.59,6.07 126.07,6.07 LED6.2
$LED7_2: length 19.5
  Top Layer w0.203: LED7.2 137.68,5.94 139.77,5.94 144.09,1.62 148.89,1.62 149.65,2.39 LED10.4
$LED8_2: length 1.6
  Top Layer w0.152: R23.1 12.98,86.39 LED8.2
$LED9_2: length 1.6
  Top Layer w0.152: LED9.2 14.78,86.38 R24.1
$LED10_2: length 19.7
  Top Layer w0.203: LED10.2 149.59,5.51 151.93,5.51 155.87,1.57 160.44,1.57 161.33,2.46 LED11.4
$LED12_2: length 55.8
  Top Layer w0.152: SW5.4 144.3,13.89 146.56,16.15 ; 143.55,13.51 143.25,13.81 137.25,13.81 136.95,13.51 ; SW8.3 SW8.4 136.89,21.58 136.92,21.62 145.6,21.62 145.64,21.58 SW6.3 ; 136.9,28.88 143.5,28.88 ; SW6.3 152.24,21.58 ; SW6.3 145.69,22.22 v1(144.49,23.41) ; v1(143.53,27.71) 143.53,29.23
  Top Layer w0.203: 146.56,16.15 146.56,20.66 145.64,21.58 ; 143.53,29.23 SW4.4
  Bottom Layer w0.152: v1(143.53,27.71) 143.53,24.38 v1(144.49,23.41)
$LED13_2: length 1.7
  Top Layer w0.152: LED13.2 46.03,10.77 R44.2
$LED14_2: length 1.7
  Top Layer w0.152: R43.1 LED14.2
$LED15_2: length 1.6
  Top Layer w0.152: R47.1 150.07,88.96 LED15.2
$LEDIR1_2: length 31.7
  Top Layer w0.152: v1(150.16,58.52) 150.18,58.54 Q2.2 ; v1(155.74,40.23) LEDIR1.2
  Top Layer w0.254: 159.62,42.51 R17.1
  Top Layer w0.406: 159.62,40.52 159.62,42.51 159.53,42.42 155.55,42.42
  Bottom Layer w0.152: v1(155.74,40.23) 155.71,40.2 152.87,40.2 150.16,42.92 v1(150.16,58.52)
$Q2_1: length 3.7
  Top Layer w0.152: R10.2 R9.2 148.43,59.19 148.25,59.37
$Q2_3: length 32.9
  Top Layer w0.254: U6.2 146.79,61.59 149.14,61.59 Q2.3 153.86,61.68 U5.2 158.75,63.6 U7.2
$Q3_1: length 4
  Top Layer w0.254: Q3.1 161.52,42.23 R17.2 161.16,42.59 R21.2
$Q3_3: length 37.5
  Top Layer w0.305: U9.2 144.72,42.24 148.76,38.2 160.25,38.2 ; U10.2 159,35.12 160.55,36.67 160.55,37.9 ; Q3.3 167.75,38.52 168.14,38.91 U8.2
$Q4_1: length 3.7
  Top Layer w0.152: Q4.1 22.09,65.73 20.43,67.4 R30.1
$Q4_2: length 18.8
  Top Layer w0.152: Q4.2 20.19,66.87 v1(19.6,67.46) ; U11.13 22.34,77.39 22.93,76.81 22.93,71.9 22.26,71.23 19.9,71.23 R31.2 17.7,70.16 v1(17.69,70.14)
  Bottom Layer w0.152: v1(17.69,70.14) 17.69,67.78 18.01,67.46 v1(19.6,67.46)
$Q5_1: length 3
  Top Layer w0.152: R31.1 18.83,65.77 Q5.1
$Q5_2: length 22.5
  Top Layer w0.152: R30.2 21.67,70.16 v1(21.7,70.19) 22.41,70.19 23.41,71.19 23.41,77.77 22.52,78.66 U11.14 ; v1(17.06,67.46) 17.06,65.73 Q5.2
  Bottom Layer w0.152: v1(21.7,70.19) 21.7,70.75 21.23,71.22 17.98,71.22 17.06,70.3 v1(17.06,67.46)
$Q6_1: length 4.7
  Top Layer w0.152: R29.1 R33.1
  Top Layer w0.203: Q6.1 162.68,27.17 162.68,29.11
$Q7_1: length 4.2
  Top Layer w0.152: R45.1 R42.1 48.01,5.39 Q7.1
$R1_1: length 2.4
  Top Layer w0.152: USBC1.B5 9.54,74.73 9.62,74.81
$R5_2: length 3.5
  Top Layer w0.152: U2.3 44.44,93.88 45.85,92.46
$R7_2: length 37.2
  Top Layer w0.254: 161.03,54.71 R7.2 ; 161.03,54.71 161.03,50.85 159.63,49.45 U1.13 ; 161.03,54.71 163.85,51.89 169.71,51.89 171.44,53.62 U3.1
$R8_2: length 2.4
  Top Layer w0.254: U4.6 24.67,114.97 25.02,115.32 R8.2
$R12_1: length 2.3
  Top Layer w0.152: USBC1.A5 9.55,77.73
$R15_2: length 38.7
  Top Layer w0.254: U7.1 159.46,65.43 155.07,65.43 U5.1 152.42,62.78 R15.2 140.71,58.05 U6.1
$R18_2: length 2.2
  Top Layer w0.254: U4.8 23.3,114.22 22.88,114.22 22.14,113.48 22.14,113.46 21.81,113.46 R18.2
$R20_2: length 47.6
  Top Layer w0.254: 168.14,44.01 169.77,42.39 169.77,38.88 164.66,33.78 154.59,33.78 U10.1 152.83,35.53 150.13,35.53 144.85,40.81 139.92,40.81 138.8,41.93 U9.1 138.8,47.3
$R38_2: length 12.8
  Top Layer w0.152: v1(147.21,71.17) 147.21,72.29 147.18,72.32
  Top Layer w0.203: U15.2 140.55,73.55 140.43,73.43 v1(140.28,73.43)
  Bottom Layer w0.152: v1(147.21,71.17) 147.21,70.89 146.3,69.97 140.81,69.97 140.28,70.51 v1(140.28,73.43)
$R56_2: length 12.7
  Top Layer w0.152: R56.2 148.97,82.93 144.82,82.93 144.37,82.47 U19.5 144.3,79.97 SW7.1
$RELAY1_3: length 19
  Top Layer w1.016: 81.42,6.18 75.24,12.37 68.09,12.37 66.49,10.77 RELAY1.3
$RELAY1_4: length 7.4
  Top Layer w1.016: RELAY1.4 72.72,9.89 76.42,6.18
$RELAY1_5: length 20
  Top Layer w1.016: RELAY1.5 82.53,2.29 86.42,6.18
$U16_3: length 1
  Top Layer w0.254: U16.3 U16.4
BAT: length 98.5
  Top Layer w0.152: 52.91,118.18 R26.2 51.29,116.44 C25.1 51.26,114.97 v1(51.26,114.97) ; v1(23.89,66.29) v1(23.89,80.51) ; v1(21.76,53.95) 21.76,52.62 21.44,52.3
  Bottom Layer w0.152: v1(23.89,66.29) 23.89,56.08 v1(21.76,53.95) ; v1(23.89,80.51) 23.87,80.54 23.87,82.8 21.66,85.01 19.88,85.01 17.92,86.97 17.92,97.28 20.06,99.41 32.38,99.41 37.46,104.49 37.46,110.41 39.18,112.14 48.43,112.14 v1(51.26,114.97)
BAT+: length 35.1
  Top Layer w0.152: R25.2 58.39,118.18
  Top Layer w0.203: U2.6 44.44,104.12 L1.2 45.57,105.05 45.6,105.08 C14.2 45.6,109.56
  Top Layer w0.61: 42.99,106.95 45.6,109.56 C16.2 45.6,110.91 46.68,111.98 59.92,111.98 60.07,111.83
BUZ: length 175.3
  Top Layer w0.152: v1(159.81,31.39) 161.08,31.39 R29.2
  Top Layer w0.203: 20.17,52.3 20.17,53.45 21.5,54.78 32.63,54.78 v1(32.68,54.83)
  Bottom Layer w0.203: v1(32.68,54.83) 34.16,56.31 34.16,61.92 38.19,65.96 43.27,65.96 45.94,63.29 87.34,63.29 94.58,56.05 94.58,39.72 103.8,30.5 158.92,30.5 v1(159.81,31.39)
DC_5V: length 63.9
  Top Layer w0.254: v1(21.63,119.73) 21.64,119.73 R22.2 21.53,117.86 C20.1
  Top Layer w0.406: PSW1.1 8.24,99.03 13.66,99.03 17.01,102.38 31.62,102.38 33.49,104.26
  Bottom Layer w0.254: v1(32.94,109.29) 32.38,108.73 19.78,108.73 18.61,109.9 18.61,118.28 20.06,119.73 v1(21.63,119.73)
EN: length 50.3
  Top Layer w0.152: Q5.3 v1(17.96,62.35) ; 10.01,34.3 10.01,35.87 v1(10,35.89) ; C28.1 7.2,27.71 9.29,27.71 9.95,28.37 9.95,25.37 ; v1(10.08,29.81) 10.08,28.76 10.01,28.7
  Top Layer w0.305: 10.01,28.7 10.01,28.43 9.95,28.37
  Bottom Layer w0.152: v1(10.08,29.81) 10.08,35.81 v1(10,35.89) 9.34,36.55 9.34,55.14 13.17,58.97 13.15,59 13.15,60.91 14.47,62.23 17.84,62.23 v1(17.96,62.35)
ESP32_RX: length 87.9
  Top Layer w0.152: 15.09,83.52 14.5,82.93 14.5,80.87 15.41,79.95 15.92,79.95 ; v1(12.16,64.66) 12.56,64.26 v1(12.56,50.69) ; 15.92,79.95 U11.2 ; 15.92,79.95 v1(17.72,79.95)
  Bottom Layer w0.152: v1(12.16,64.66) 12.16,66.52 18.48,72.84 18.48,79.19 v1(17.72,79.95)
  Bottom Layer w0.203: U13.4 15.44,12.42 15.44,23.06 11.57,26.92 11.57,36.42 10.51,37.49 10.51,48.59 12.62,50.69
ESP32_TX: length 90.7
  Top Layer w0.152: v1(11.27,50.67) v1(11.27,64.69) ; LED8.1 12.92,83.19 12.92,80.77 15.05,78.63 15.92,78.63 ; 15.92,78.63 U11.3 ; 15.92,78.63 v1(17.75,78.63)
  Bottom Layer w0.152: v1(17.75,78.63) 18.15,78.23 18.15,72.94 11.27,66.06 v1(11.27,64.69)
  Bottom Layer w0.203: U13.5 20.97,5.13 14.7,11.4 14.7,22.75 10.94,26.51 10.94,36.32 10.05,37.21 10.05,49.6 11.07,50.62 11.32,50.62
IO0: length 44.6
  Top Layer w0.152: v1(21.14,63.68) 21.18,63.65 v1(21.18,62.3) ; C29.1 6.49,55.6 v1(7.43,55.6) 7.41,55.62 R34.1 9.59,59.55 SW2.1
  Top Layer w0.203: v1(23.92,50.87) 23.98,50.94 23.98,52.3
  Bottom Layer w0.152: v1(7.43,55.6) 9.14,55.6 12.87,59.33 12.87,61.34 14.41,62.88 20.6,62.88 v1(21.18,62.3) 20.21,61.34 20.21,52.32 21.66,50.87 v1(23.92,50.87)
KEY_D: length 139.7
  Top Layer w0.152: R49.2 141.62,19.53 143.55,17.59 136.95,17.59
  Top Layer w0.203: 136.95,17.59 136.77,17.78 122.17,17.78 115.79,24.15 50.74,24.15 47.36,20.77 43.63,20.77 40.25,24.15 26.63,24.15 17.63,33.15 17.63,34.3
KEY_L: length 122.6
  Top Layer w0.152: 132.27,26.92 133.91,25.28 SW8.2 SW8.1
  Top Layer w0.203: 20.17,34.3 20.17,32.57 27.04,25.7 127.79,25.7 SW8.1
KEY_M: length 139.6
  Top Layer w0.152: 136.92,25.32 143.52,25.32 142.9,25.32 141.35,26.86 140.87,26.86
  Top Layer w0.203: 18.9,34.3 18.9,33.15 27.22,24.84 116.2,24.84 122.6,18.44 123.87,18.44 125.77,20.34 125.77,22.19 127.25,23.67 136.21,23.67 136.92,24.38 SW3.1
KEY_R: length 169.3
  Top Layer w0.152: 145.64,25.28 152.24,25.28 151.57,25.28 149.99,26.86 R54.2
  Top Layer w0.203: 16.36,34.3 16.36,33.15 26.18,23.34 40.17,23.34 43.43,20.09 47.77,20.09 51.25,23.57 115.38,23.57 121.84,17.12 127.58,17.12 132.53,12.16 145.99,12.16 153.89,20.06 153.89,23.74 152.36,25.28 SW6.2
KEY_U: length 125.6
  Top Layer w0.152: SW4.1 136.9,32.55 R46.2
  Top Layer w0.203: SW4.1 136.7,32.76 129.74,32.76 123.18,26.21 27.4,26.21 21.44,32.16 21.44,34.3
LUM: length 27.2
  Top Layer w0.152: R27.2 33.47,35.77 R28.1 30.46,35.81 12.71,35.81 12.55,35.66 12.55,34.3
OLED_SCL: length 274.5
  Top Layer w0.152: v1(138.32,76.68) 139.31,77.67 145.4,77.67 146.91,79.17 U19.7 146.91,81.07 147.36,81.53 149.53,81.53 R53.2
  Top Layer w0.203: R39.2 141.15,71.3 U15.4 ; v1(10,54) 10.01,53.98 10.01,52.3 ; U1.2 151.93,52.11 R2.1 147.72,53.97 138.19,53.97 135.75,56.41 v1(135.75,63.7)
  Top Layer w0.254: v1(123.36,62.86) 123.33,62.89 45.64,62.89 43.38,65.15 38.37,65.15 32.96,59.74 v1(14.67,59.74) ; 135.73,101.52 v1(135.73,76.7) v1(135.73,75.08) 135.75,75.05 v1(135.75,65.96) 148.15,65.96 152.98,70.79 152.98,72.13 152.52,72.58 U16.7 ; 135.73,101.52 135.7,101.49 ; 135.73,101.52 141.44,107.23 146.14,107.23 152.89,113.98 R36.1 153.76,119.18 153.76,120.65 ; U15.4 141.06,72.64 v1(138.32,72.64)
  Bottom Layer w0.203: v1(10,54) 10,55.14 14.6,59.74 v1(14.67,59.74)
  Bottom Layer w0.254: v1(123.36,62.86) 134.99,62.86 135.75,63.62 v1(135.75,65.96) ; v1(135.73,75.08) 135.88,75.08 v1(138.32,72.64) ; v1(138.32,76.68) 138.3,76.7 v1(135.73,76.7)
OLED_SDA: length 266.8
  Top Layer w0.152: R55.2 146.31,82.48 145.66,81.83 145.66,79.93 U19.6
  Top Layer w0.203: 149.57,50.36 149.57,50.24 147.87,48.54 144.62,48.54 140.99,52.17 137.96,52.17 134.51,55.62 134.51,62.17 v1(134.5,62.18) ; 149.57,50.36 149.93,50.72 U1.3 ; 149.57,50.36 R4.1 ; U15.1 141.15,76.16 R40.2
  Top Layer w0.254: 137.08,74.31 137.08,74.06 137.09,74.05 ; 137.08,74.31 137.08,78.51 ; 137.08,74.31 137.33,74.05 ; U19.6 145.64,78.95 145.38,78.7 137.26,78.7 ; 137.08,78.51 137.26,78.7 ; 137.08,78.51 137.08,78.88 ; 137.26,78.7 137.08,78.88 ; 137.08,78.88 137.08,101.01 142.38,106.32 147.29,106.32 155.97,115.01 155.97,120.32 156.3,120.65 ; 137.09,73.81 137.09,66.73 v1(137.15,66.67) 139.95,69.46 148.71,69.46 150.11,70.87 150.11,71.63 ; 137.09,73.81 137.09,74.05 ; 137.09,73.81 137.33,74.05 ; 137.33,74.05 U15.1 ; 137.33,74.05 137.09,74.05 ; 13.82,52.3 13.82,53.76 19.12,59.05 33.49,59.05 38.68,64.23 38.68,64.36 43.17,64.36 45.46,62.07 v1(123.36,62.07)
  Bottom Layer w0.254: v1(137.15,66.67) 137.15,63.06 136.26,62.18 v1(134.5,62.18) 134.4,62.07 v1(123.36,62.07)
PA1: length 20.1
  Top Layer w0.152: U1.9 157.52,44.37 v1(155.64,44.37) ; R9.1 151.3,57.25
  Top Layer w0.254: U1.9 R21.1
  Bottom Layer w0.152: v1(151.3,57.25) 151.3,55.85 151.35,55.8 151.38,55.8 154.17,53.01 154.17,48.59 155.64,47.11 v1(155.64,44.37)
PRX: length 173.8
  Top Layer w0.152: v1(136.11,34.36) 129.66,34.36 122.57,27.28 47.77,27.28 47.62,27.12 27.47,27.12 23.98,30.61 23.98,34.3 ; v1(148.53,68.47) 147.06,67 v1(139.46,67) ; v1(148.91,73.05) 148.94,73.05
  Top Layer w0.254: R35.1 148.91,74.92 148.91,73.07 149.4,72.58 U16.2
  Bottom Layer w0.152: v1(148.53,68.47) 148.53,72.67 v1(148.91,73.05) ; v1(139.46,67) 138.12,65.65 138.12,62.05 136.11,60.04 v1(136.11,34.36)
RGB: length 148.7
  Top Layer w0.203: v1(34.74,54.81) 33.75,53.82 23.44,53.82 22.83,53.21 22.83,52.42 22.71,52.3 ; v1(92.75,4.11) 92.75,3.15 94.2,1.7 102.94,1.7 103.73,2.49 LED3.4
  Bottom Layer w0.203: v1(34.74,54.81) 34.79,54.81 35.25,55.27 35.25,61.08 38.75,64.59 42.33,64.59 45.61,61.31 87.5,61.31 92.75,56.05 v1(92.75,4.11)
RLY: length 53.7
  Top Layer w0.152: 11.28,34.3 11.28,33.51 22.73,22.07 22.73,12.7 24.6,10.82 38.47,10.82 42.14,7.15 R42.2
SD_CLK: length 32
  Top Layer w0.152: v1(28.24,12.21) 28.97,12.21 30.53,13.77 CARD1.5 30.53,16.74 R50.2 ; 22.71,34.3 22.67,34.26 v1(22.67,32.81)
  Bottom Layer w0.152: v1(28.24,12.21) 23.46,16.99 23.46,32.03 v1(22.67,32.81)
SD_MISO: length 40.7
  Top Layer w0.152: 25.48,49.02 25.5,49.04 v1(27.91,49.04) ; CARD1.7 28.33,16.34 v1(28.31,16.35) 28.31,18.61 R48.2
  Bottom Layer w0.152: v1(28.31,16.35) 27.91,16.76 v1(27.91,49.04)
SD_MOSI: length 40
  Top Layer w0.152: R51.2 33.79,17.39 v1(32.66,16.25) 32.73,16.18 CARD1.3 ; 25.48,47.75 28.44,47.75 v1(28.47,47.72)
  Bottom Layer w0.152: v1(28.47,47.72) 28.47,20.44 32.66,16.25
SD_SS: length 33.9
  Top Layer w0.152: v1(29.13,38.81) 25.53,38.81 25.48,38.86 ; 33.83,14.64 33.83,16.23 v1(33.81,16.25) 34.71,17.16 34.71,18.68 R52.2
  Bottom Layer w0.152: v1(29.13,38.81) 29.13,20.93 v1(33.81,16.25)
TFT_CLK: length 51
  Top Layer w0.203: 17.63,52.3 17.63,53.43 20.69,56.48 v1(36.29,56.48) 37.63,55.14 37.63,31.32 40.63,28.32
TFT_CS: length 26.1
  Top Layer w0.203: 18.9,52.3 18.9,51.15 19.84,50.21 27.7,50.21 34.43,43.48 v1(35.27,43.48)
  Bottom Layer w0.203: 40.63,43.56 40.56,43.48 v1(35.27,43.48)
TFT_MISO: length 51.1
  Top Layer w0.203: 16.36,52.3 16.36,53.45 20.28,57.37 36.31,57.37 v1(36.34,57.4) 38.17,55.57 38.17,33.32 40.63,30.86
TFT_MOSI: length 69
  Top Layer w0.203: 8.74,54.9 10.7,54.9 v1(10.71,54.91) ; 8.74,54.9 8.74,52.3 ; 8.74,54.9 8.73,54.91 ; 40.63,35.94 43.07,38.37 43.07,62.99 42.41,63.65 39.13,63.65 33.75,58.26 19.75,58.26 v1(19.63,58.14)
  Bottom Layer w0.203: v1(10.71,54.91) 14.06,58.26 19.5,58.26 v1(19.63,58.14)
TFT_RS: length 49.8
  Top Layer w0.203: 15.09,34.3 15.09,33.15 26.18,22.07 v1(39.49,22.07)
  Bottom Layer w0.203: v1(39.49,22.07) 39.49,22.19 43.07,25.78 43.07,37.41 42,38.48 40.63,38.48
TFT_RST: length 54.7
  Top Layer w0.203: v1(39.51,21.23) 39.36,21.38 25.59,21.38 13.82,33.15 13.82,34.3
  Bottom Layer w0.203: v1(39.51,21.23) 39.64,21.23 43.78,25.37 43.78,37.87 40.63,41.02
USB_5V: length 29.6
  Top Layer w0.152: R14.2 9.62,73.23 9.27,73.58
  Top Layer w0.305: USBC1.B4 6.48,74.23 6.34,74.37 6.27,74.37 5.5,75.13 5.5,77.77 6.47,78.74 6.48,78.73 USBC1.B9 9.35,78.73 10.61,79.98 10.61,87.7 7.93,90.38 PSW1.3 ; 9.27,73.58 8.7,73.58 8.36,73.93 USBC1.A9
USB_D+: length 24.1
  Top Layer w0.203: 15.43,76.1 16.17,76.1 17.72,74.54 17.72,71.29 16.86,70.43 14.04,70.43 12.89,71.58 12.89,75.18 12.35,75.73 USBC1.B6 6.46,75.73 6.22,75.97 6.22,76.53 6.41,76.73 USBC1.A6
USB_D-: length 24.3
  Top Layer w0.203: USBC1.B7 8.01,77.23 8.25,76.99 8.25,76.52 7.96,76.23 9.51,76.23 arc(9.69,76.3) 9.77,76.48 9.77,76.6 arc(10.02,76.86) 10.27,76.6 10.27,76.48 arc(10.53,76.23) 10.78,76.48 10.78,76.6 arc(11.04,76.86) 11.29,76.6 11.29,76.48 arc(11.54,76.23) 11.8,76.48 11.8,76.6 arc(12.05,76.86) 12.31,76.6 12.31,76.48 arc(12.38,76.3) 12.56,76.23 13.38,75.41 13.38,71.6 14.19,70.79 16.67,70.79 17.31,71.43 17.31,74.29 16.78,74.83 15.43,74.83
  Top Layer w0.305: USBC1.A7 7.96,76.23

## Copper pours and planes (outline as drawn; the poured copper is in the pictures)
3.3V on Top Layer: 12.41,29.36 14.93,29.36 14.93,26.87 12.41,26.87
3.3V on Top Layer: 32.1,88.36 38.42,88.36 38.42,75.61 32.1,75.61
3.3V on Bottom Layer: 12.41,29.36 14.93,29.36 14.93,26.87 12.41,26.87
5V on Top Layer: 20.69,96.59 33.47,96.59 33.47,85.64 20.69,85.64
GND on Top Layer: 11.12,46.81 20.62,46.81 20.62,37.64 11.12,37.64
GND on Top Layer: 0.32,84.63 9.14,84.63 9.14,69.34 0.32,69.34
GND on Top Layer: 24.63,112.34 31.11,112.34 31.11,103.4 24.63,103.4
GND on Top Layer: 33.7,110.94 56.15,110.94 56.15,78.13 33.7,78.13
GND on Top Layer: 5.49,122.78 37.49,122.78 37.49,100.88 5.49,100.88
GND on Top Layer: 125.57,121.79 132.17,121.79 132.17,81.83 125.57,81.83
VIN_5V on Top Layer: 20.64,101.39 32.96,101.39 32.96,97.21 20.64,97.21
$C3_1 on Top Layer: 33.67,98.14 42.71,98.14 42.71,92.15 33.67,92.15
$C6_2 on Top Layer: 12.74,112.34 24.45,112.34 24.45,103.17 12.74,103.17
$C12_2 on Top Layer: 45.36,102.05 52.42,102.05 52.42,97.58 45.36,97.58
$C17_1 on Top Layer: 24.43,116.9 29.63,116.9 29.63,111.01 24.43,111.01
$C17_2 on Top Layer: 26.19,118.26 29.13,118.26 29.13,117.42 26.19,117.42
$D3_2 on Top Layer: 36.8,107.1 42.44,107.1 42.44,99.82 36.8,99.82
$R16_1 on Top Layer: 25.06,116.89 27.37,116.89 27.37,113.48 25.06,113.48
BAT+ on Top Layer: 42.61,110.92 46.35,110.92 46.35,99.87 42.61,99.87
BAT+ on Top Layer: 57.27,122.37 65.3,122.37 65.3,79.95 57.27,79.95
DC_5V on Top Layer: 31.51,114.42 36.82,114.42 36.82,103.42 31.51,103.42

## Text on the board
Top Silkscreen Layer: GND | 5-16Vin | 5Vo | 3.3V | V2.2 | ESP32-Gateway
